# EAGLE design board (EAGLE 9.3.0)

## Sheet 1 of 2
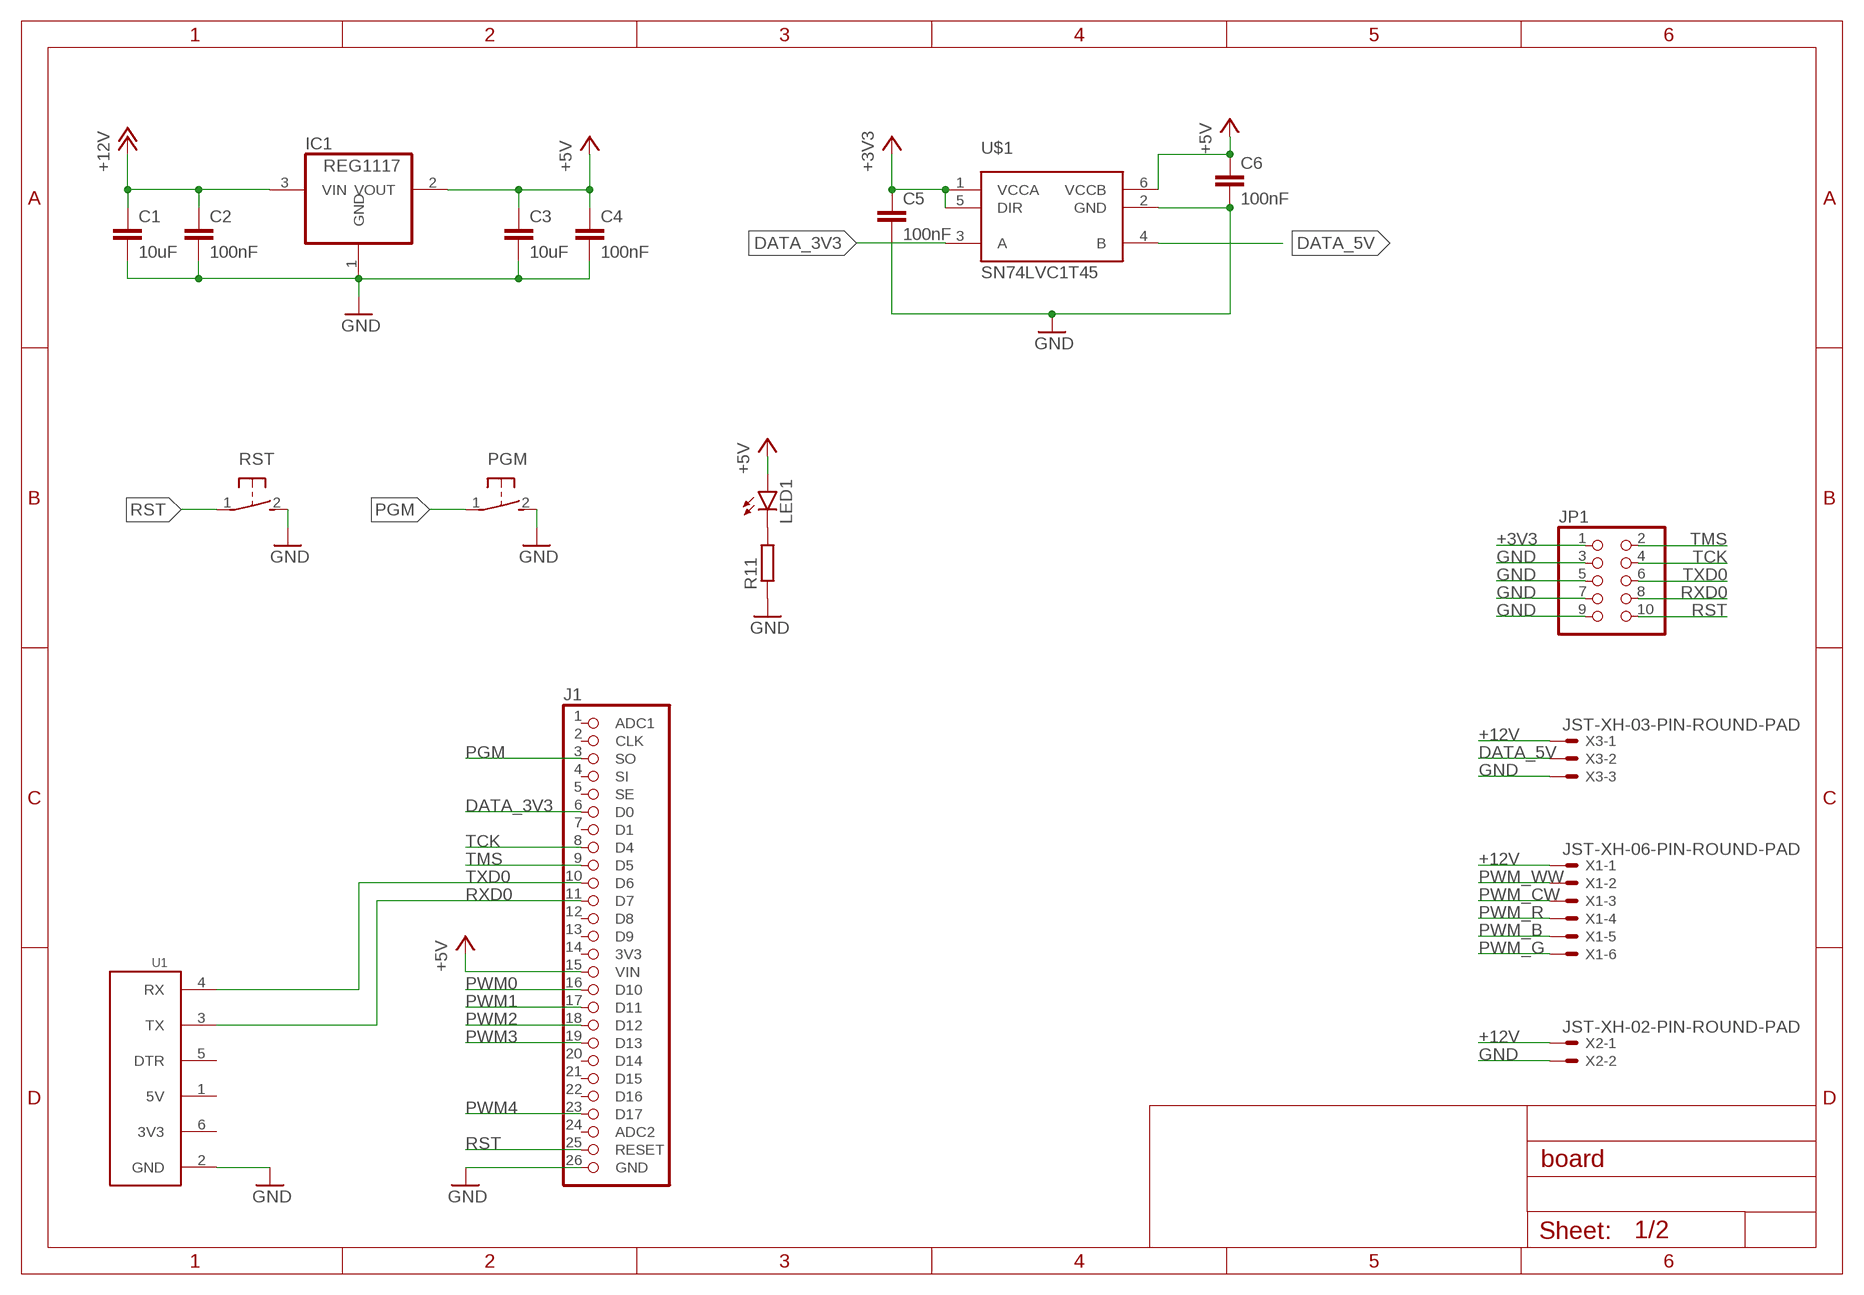
[diagram p0: schematic, sheet 1]

### Parts
C1  10uF  C-EUC0603  [C0603]
C2  100nF  C-EUC0603  [C0603]
C3  10uF  C-EUC0603  [C0603]
C4  100nF  C-EUC0603  [C0603]
C5  100nF  C-EUC0603  [C0603]
C6  100nF  C-EUC0603  [C0603]
IC1  REG1117  [SOT223]
J1  E75-2G4M20S-SOCKET  [E75-2G4M20S-SOCKET]
JP1  PINHD-2X5  [2X05]
LED1  LEDCHIP-LED0603  [CHIP-LED0603]
PGM  BUTTON3X4  [BUTTON3X4]
R11  R-EU_R0603  [R0603]
RST  BUTTON3X4  [BUTTON3X4]
U1  CP2102-BOARD  [CP2102-BOARD]
U$1  SN74LVC1T45  [SOT23-6]
X1  JST-XH-06-PIN-ROUND-PAD  [JST-XH-06-PACKAGE-ROUND-PAD]
X2  JST-XH-02-PIN-ROUND-PAD  [JST-XH-02-PACKAGE-ROUND-PAD]
X3  JST-XH-03-PIN-ROUND-PAD  [JST-XH-03-PACKAGE-ROUND-PAD]

### Nets
+3V3: C5.1 JP1.1 U$1.1(VCCA) U$1.5(DIR)
+5V: C3.1 C4.1 C6.1 IC1.2(VOUT) J1.15(VIN) LED1.A U$1.6(VCCB)
+12V: C1.1 C2.1 IC1.3(VIN) X1.1 X2.1 X3.1
DATA_3V3: J1.6(D0) U$1.3(A)
DATA_5V: U$1.4(B) X3.2
GND: C1.2 C2.2 C3.2 C4.2 C5.2 C6.2 IC1.1(GND) J1.26(GND) JP1.3 JP1.5 JP1.7 JP1.9 PGM.2(S) R11.1 RST.2(S) U1.2(GND) U$1.2(GND) X2.2 X3.3 ; also sheet 2
N$8: LED1.C R11.2
PGM: J1.3(SO) PGM.1(P)
PWM0: J1.16(D10) ; also sheet 2
PWM1: J1.17(D11) ; also sheet 2
PWM2: J1.18(D12) ; also sheet 2
PWM3: J1.19(D13) ; also sheet 2
PWM4: J1.23(D17) ; also sheet 2
PWM_B: X1.5 ; also sheet 2
PWM_CW: X1.3 ; also sheet 2
PWM_G: X1.6 ; also sheet 2
PWM_R: X1.4 ; also sheet 2
PWM_WW: X1.2 ; also sheet 2
RST: J1.25(RESET) JP1.10 RST.1(P)
RXD0: J1.11(D7) JP1.8 U1.3(TX)
TCK: J1.8(D4) JP1.4
TMS: J1.9(D5) JP1.2
TXD0: J1.10(D6) JP1.6 U1.4(RX)
Unconnected: J1.1(ADC1) J1.2(CLK) J1.4(SI) J1.5(SE) J1.7(D1) J1.12(D8) J1.13(D9) J1.14(3V3) J1.20(D14) J1.21(D15) J1.22(D16) J1.24(ADC2) U1.1(5V) U1.5(DTR) U1.6(3V3)

## Sheet 2 of 2
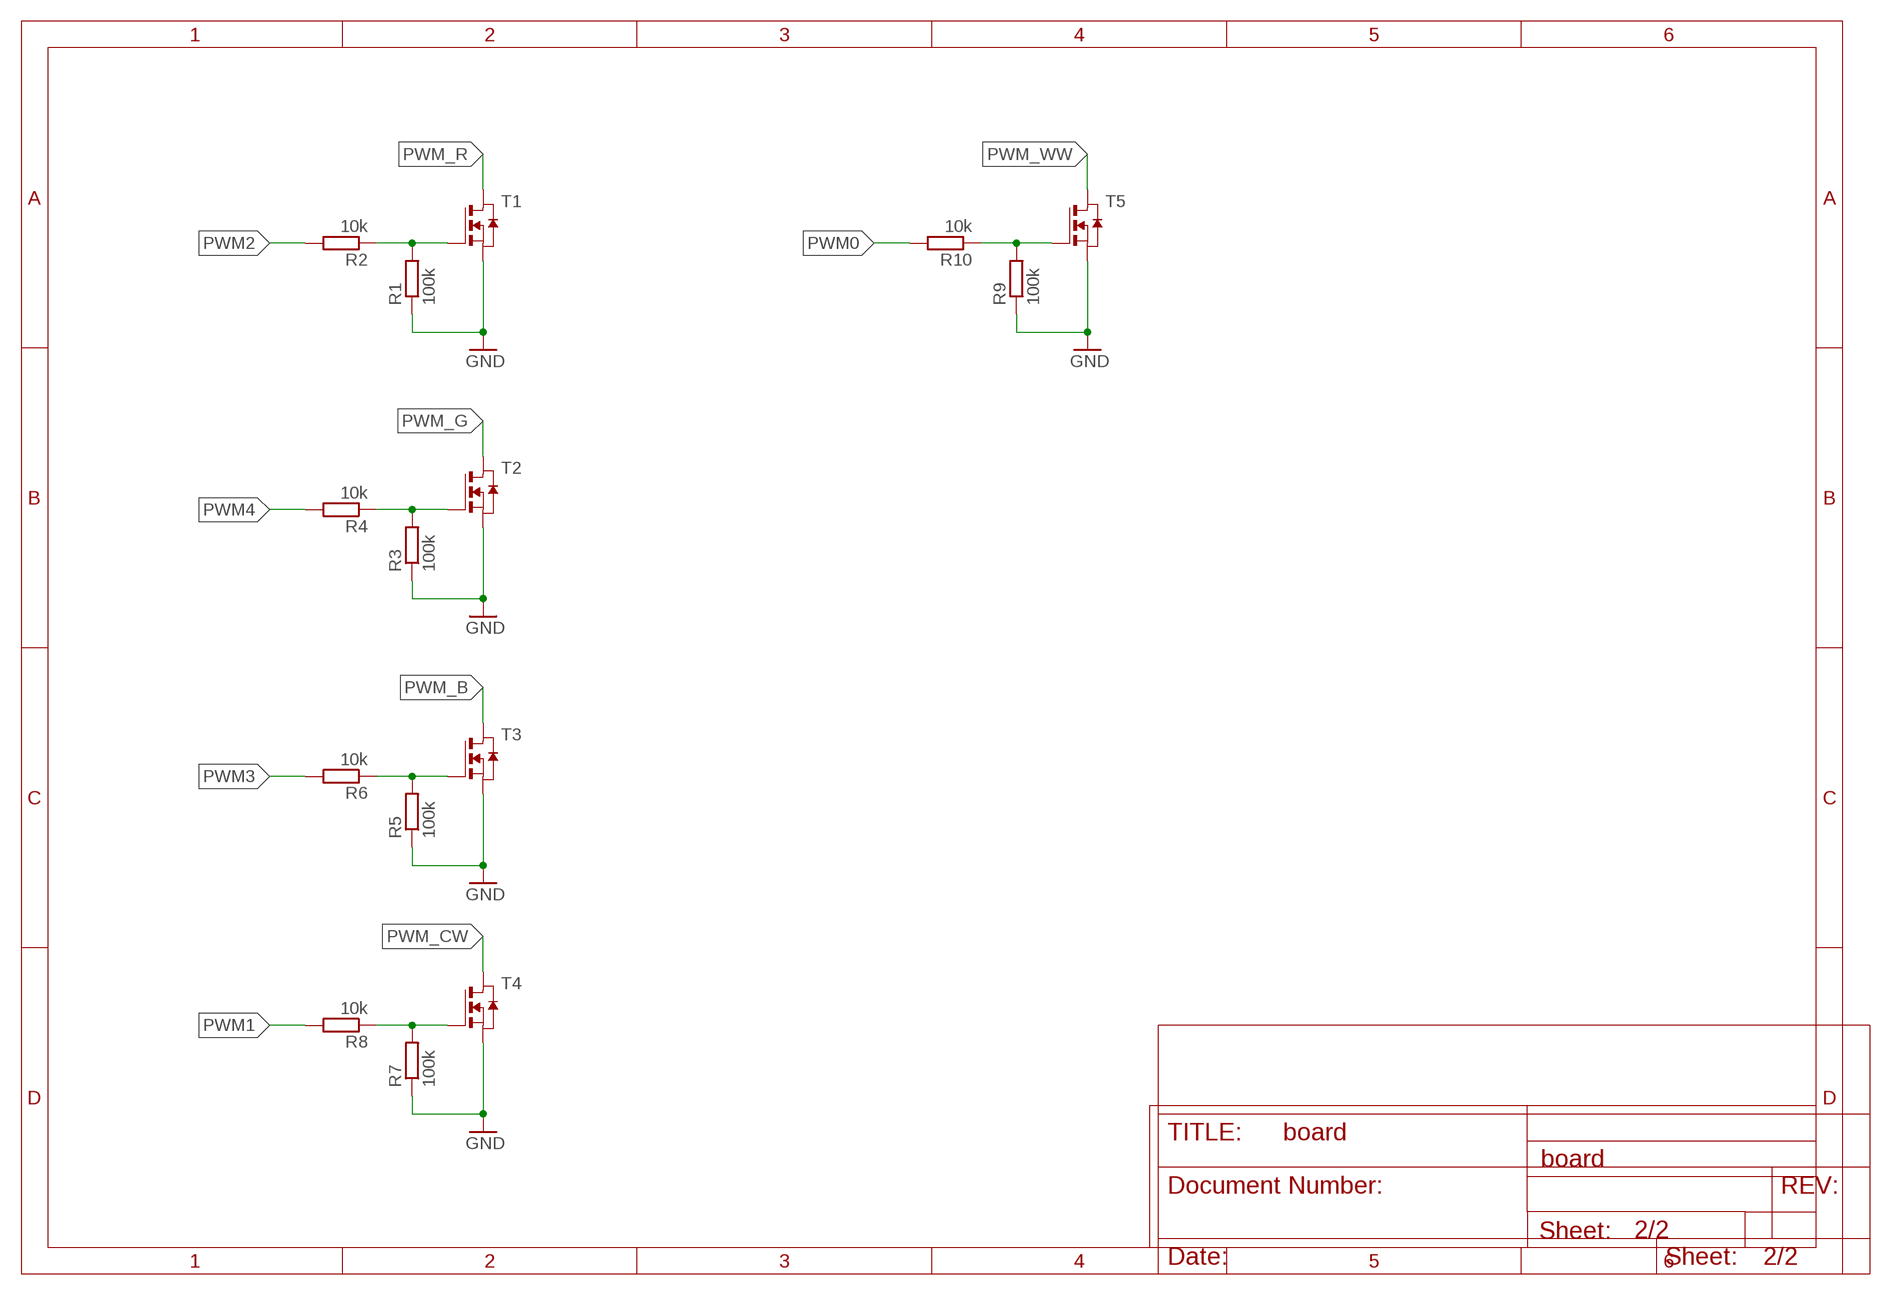
[diagram p1: schematic, sheet 2]

### Parts
R1  100k  R-EU_R0603  [R0603]
R2  10k  R-EU_R0603  [R0603]
R3  100k  R-EU_R0603  [R0603]
R4  10k  R-EU_R0603  [R0603]
R5  100k  R-EU_R0603  [R0603]
R6  10k  R-EU_R0603  [R0603]
R7  100k  R-EU_R0603  [R0603]
R8  10k  R-EU_R0603  [R0603]
R9  100k  R-EU_R0603  [R0603]
R10  10k  R-EU_R0603  [R0603]
T1  NMOSSOT23  [SOT-23]
T2  NMOSSOT23  [SOT-23]
T3  NMOSSOT23  [SOT-23]
T4  NMOSSOT23  [SOT-23]
T5  NMOSSOT23  [SOT-23]

### Nets
GND: R1.1 R3.1 R5.1 R7.1 R9.1 T1.2(S) T2.2(S) T3.2(S) T4.2(S) T5.2(S) ; also sheet 1
N$1: R1.2 R2.1 T1.3(G)
N$4: R3.2 R4.1 T2.3(G)
N$5: R5.2 R6.1 T3.3(G)
N$6: R7.2 R8.1 T4.3(G)
N$7: R9.2 R10.1 T5.3(G)
PWM0: R10.2 ; also sheet 1
PWM1: R8.2 ; also sheet 1
PWM2: R2.2 ; also sheet 1
PWM3: R6.2 ; also sheet 1
PWM4: R4.2 ; also sheet 1
PWM_B: T3.1(D) ; also sheet 1
PWM_CW: T4.1(D) ; also sheet 1
PWM_G: T2.1(D) ; also sheet 1
PWM_R: T1.1(D) ; also sheet 1
PWM_WW: T5.1(D) ; also sheet 1

## Library data of the parts
C1-C6 = rcl:C-EU: CAPACITOR, European symbol; SPICEPREFIX: C
IC1 = burr-brown:REG1117: 800mA and 1A Low Dropout (LDO) Positive Regulator 1.8V, 2.5V, 2.85V, 3.3V, 5V, and Adj; MPN: REG1117; OC_FARNELL: 1097566; OC_NEWARK: 14P6981
J1 = E75-2G4M20S:E75-2G4M20S-SOCKET
JP1 = pinhead:PINHD-2X5: PIN HEADER
LED1 = led:LED: LED OSRAM: - CHIPLED LG R971, LG N971, LY N971, LG Q971, LY Q971, LO R971, LY R971 LH N974, LH R974 LS Q976, LO Q976, LY Q976 LO Q996 - Hyper CHIPLED LW Q18S LB Q993, LB Q99A, LB R99A - SideLED LS A670, LO A670, LY A670, LG A670, LP A670 LB A673, LV A673, LT A673, LW A673 LH A674 LY A675 LS A676, LA A676, LO A676, LY A676, LW A676 LS A679, LY A679, LG A679 - Hyper Micro SIDELED® LS Y876, LA Y876, LO Y876, LY Y876 LT Y87S - SmartLED LW L88C, LW L88S LB L89C, LB L89S, LG L890 LS L89K, LO L89K, LY L89K LS L896, LA L896, LO L896, LY L896 - TOPLED LS T670, LO T670, LY T670, LG T670, LP T670 LSG T670, LSP T670, LSY T670, LOP T670, LYG T670 LG T671, LOG T671, LSG T671 LB T673, LV T673, LT T673, LW T673 LH T674 LS T676, LA T676, LO T676, LY T676, LB T676, LH T676, LSB T676, LW T676 LB T67C, LV T67C, LT T67C, LS T67K, LO T67K, LY T67K, LW E67C LS E67B, LA E67B, LO E67B, LY E67B, LB E67C, LV E67C, LT E67C LW T67C LS T679, LY T679, LG T679 LS T770, LO T770, LY T770, LG T770, LP T770 LB T773, LV T773, LT T773, LW T773 LH T774 LS E675, LA E675, LY E675, LS T675 LS T776, LA T776, LO T776, LY T776, LB T776 LHGB T686 LT T68C, LB T68C - Hyper Mini TOPLED® LB M676 - Mini TOPLED Santana® LG M470 LS M47K, LO M47K, LY M47K Source: http://www.osram.convergy.de LUXEON: - LUMILED® LXK2-PW12-R00, LXK2-PW12-S00, LXK2-PW14-U00, LXK2-PW14-V00 LXK2-PM12-R00, LXK2-PM12-S00, LXK2-PM14-U00 LXK2-PE12-Q00, LXK2-PE12-R00, LXK2-PE12-S00, LXK2-PE14-T00, LXK2-PE14-U00 LXK2-PB12-K00, LXK2-PB12-L00, LXK2-PB12-M00, LXK2-PB14-N00, LXK2-PB14-P00, LXK2-PB14-Q00 LXK2-PR12-L00, LXK2-PR12-M00, LXK2-PR14-Q00, LXK2-PR14-R00 LXK2-PD12-Q00, LXK2-PD12-R00, LXK2-PD12-S00 LXK2-PH12-R00, LXK2-PH12-S00 LXK2-PL12-P00, LXK2-PL12-Q00, LXK2-PL12-R00 Source: www.luxeon.com KINGBRIGHT: KA-3528ASYC Source: www.kingbright.com
PGM RST = E75-2G4M20S:BUTTON3X4
R1-R11 = rcl:R-EU_: RESISTOR, European symbol; SPICEPREFIX: R
T1-T5 = zetex:NMOSSOT23: MOS FET; OC_FARNELL: unknown; OC_NEWARK: unknown
U1 = E75-2G4M20S:CP2102-BOARD
U$1 = SN74LVC1T45:SN74LVC1T45; AVAILABILITY: Unavailable; DESCRIPTION: Single-Bit Dual-Supply Bus Transceiver with Configurable Voltage Translation and 3-State Outputs; MF: Texas Instruments; MP: SN74LVC1T45; PACKAGE: None; PRICE: None
X1 = Rembrandt Electronics - JST XH Connectors v1-0:JST-XH-06-PIN: JST XH Connector 2 Pin Wire to board connector. Pitch: 2,54 mm, (0.100") Number of pins: 6 Created by Rembrandt Electronics www.rembrandtelectronics.com
X2 = Rembrandt Electronics - JST XH Connectors v1-0:JST-XH-02-PIN: JST XH Connector 2 Pin Wire to board connector. Pitch: 2,54 mm, (0.100") Number of pins: 2 Created by Rembrandt Electronics www.rembrandtelectronics.com
X3 = Rembrandt Electronics - JST XH Connectors v1-0:JST-XH-03-PIN: JST XH Connector 2 Pin Wire to board connector. Pitch: 2,54 mm, (0.100") Number of pins: 3 Created by Rembrandt Electronics www.rembrandtelectronics.com

## Board
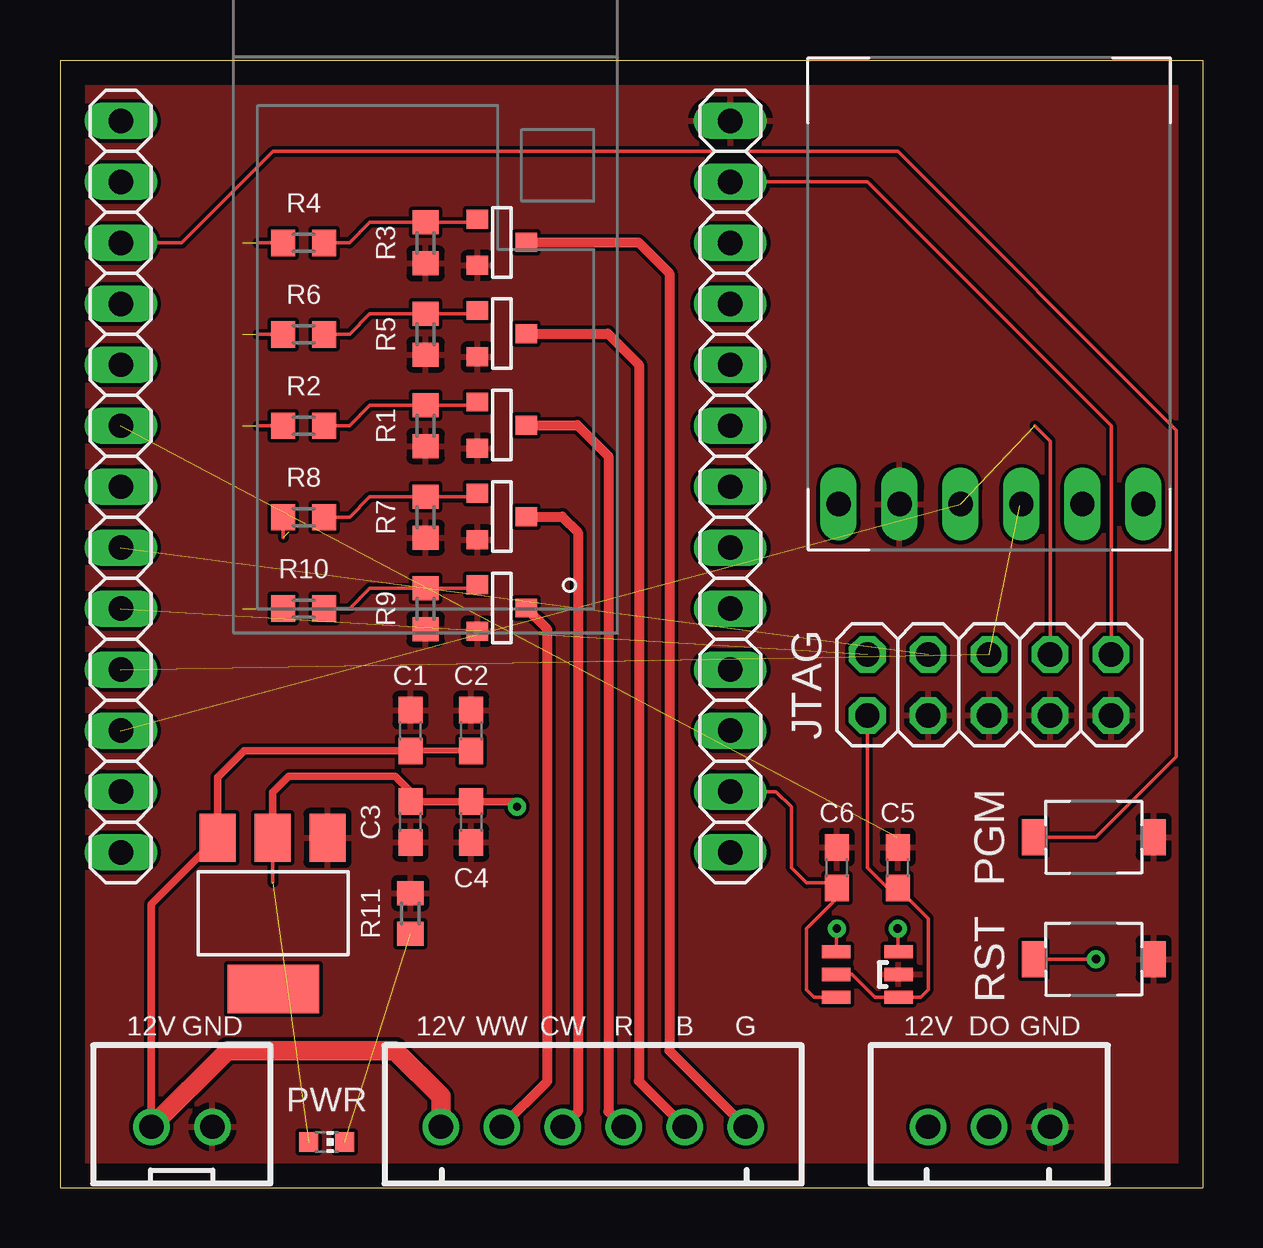
[diagram p2: board, top side]
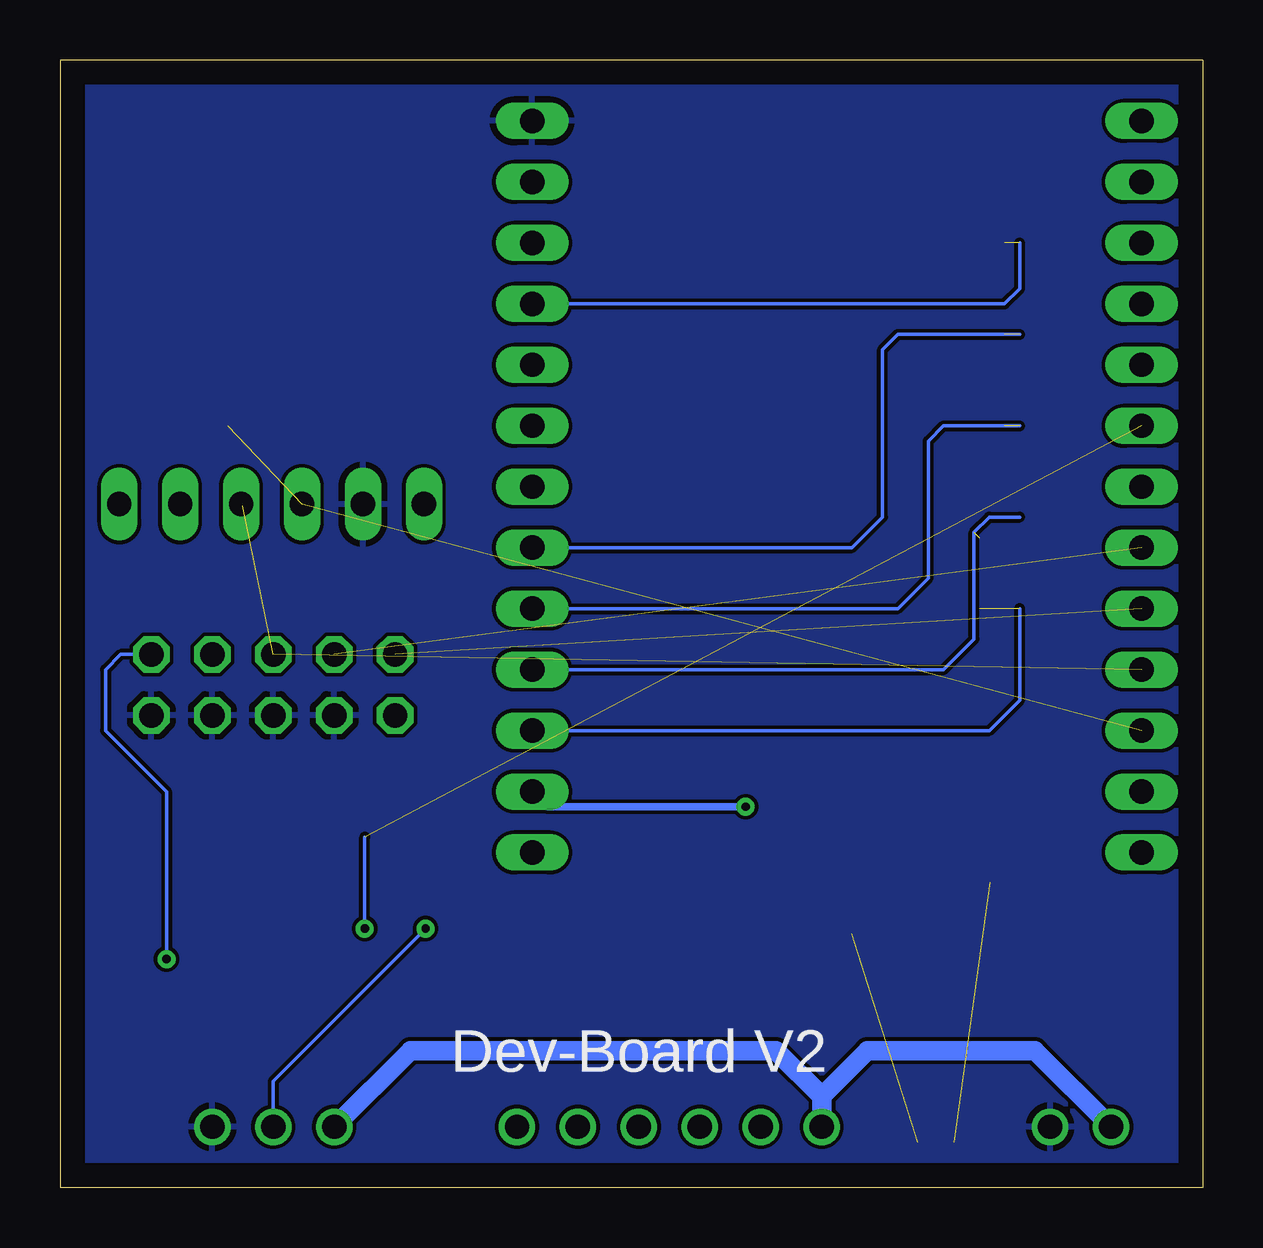
[diagram p3: board, bottom side, seen from below]

Size 47.62 x 46.99 mm. Coordinates in mm from the lower left corner, seen from the top.
Outline: 0,0 47.62,0 47.62,46.99 0,46.99 0,0
Copper layers (1*16): Top 0.035mm / dielectric 1.5mm / Bottom 0.035mm
Design rules "default": minimum track width 6mil, minimum drill 0.35mm, track to track 6mil, track to pad 6mil, pad to pad 6mil, via to via 6mil, smd to smd 6mil, copper to edge 40mil, drill to drill 6mil, minimum pad ring 10mil, minimum via ring 8mil, stop-mask expansion 4mil, vias tented up to drill 0mil, thermal gap 10mil

### Footprints (pad centres in the part's own frame; a part is rotated, then mirrored left to right if it is on the bottom)
C0603 = smd 1.1 x 1: 1 -0.85,0; 2 0.85,0
SOT223 = smd 1.499 x 2.007: 1 -2.261,-3.15; 2 0.025,-3.15; 3 2.311,-3.15 | smd 3.81 x 2.007: 4 0,3.15
E75-2G4M20S-SOCKET = drill 1.016 long: 1 -15.24,-12.7; 2 -12.7,-12.7; 3 -10.16,-12.7; 4 -7.62,-12.7; 5 -5.08,-12.7; 6 -2.54,-12.7; 7 0,-12.7; 8 2.54,-12.7; 9 5.08,-12.7; 10 7.62,-12.7; 11 10.16,-12.7; 12 12.7,-12.7; 13 15.24,-12.7; 14 15.24,12.7; 15 12.7,12.7; 16 10.16,12.7; 17 7.62,12.7; 18 5.08,12.7; 19 2.54,12.7; 20 0,12.7; 21 -2.54,12.7; 22 -5.08,12.7; 23 -7.62,12.7; 24 -10.16,12.7; 25 -12.7,12.7; 26 -15.24,12.7
2X05 = drill 1.016 octagon: 1 -5.08,-1.27; 2 -5.08,1.27; 3 -2.54,-1.27; 4 -2.54,1.27; 5 0,-1.27; 6 0,1.27; 7 2.54,-1.27; 8 2.54,1.27; 9 5.08,-1.27; 10 5.08,1.27
CHIP-LED0603 = smd 0.8 x 0.8: A 0,-0.75; C 0,0.75
BUTTON3X4 = smd 1 x 1.5: 1 -2.5,0; 2 2.5,0
R0603 = smd 1 x 1.1: 1 -0.85,0; 2 0.85,0
SOT-23 = smd 0.787 x 0.889: 1 0.025,-1.016; 2 -0.94,1.016; 3 0.991,1.016
CP2102-BOARD = drill 1.016 long: 1 -6.28,-8.345; 2 -3.74,-8.345; 3 -1.2,-8.345; 4 1.34,-8.345; 5 3.88,-8.345; 6 6.42,-8.345
SOT23-6 = smd 0.55 x 1.2: 1 -0.95,-1.3; 2 0,-1.3; 3 0.95,-1.3; 4 0.95,1.3; 5 0,1.3; 6 -0.95,1.3
JST-XH-06-PACKAGE-ROUND-PAD = drill 1.016: 1 -6.35,0; 2 -3.81,0; 3 -1.27,0; 4 1.27,0; 5 3.81,0; 6 6.35,0
JST-XH-02-PACKAGE-ROUND-PAD = drill 1.016: 1 -1.27,0; 2 1.27,0
JST-XH-03-PACKAGE-ROUND-PAD = drill 1.016: 1 -2.54,0; 2 0,0; 3 2.54,0

### Placement (x,y rotation side)
C1  14.61,19.05 90 top
C2  17.14,19.05 90 top
C3  14.61,15.24 270 top
C4  17.14,15.24 270 top
C5  34.92,13.34 90 top
C6  32.38,13.34 90 top
IC1  8.89,11.43 180 top
J1  15.24,29.21 270 top
JP1  38.73,20.95 0 top
LED1  11.11,1.91 270 top
PGM  43.09,14.61 0 top
R1  15.24,31.75 90 top
R2  10.16,31.75 180 top
R3  15.24,39.37 90 top
R4  10.16,39.37 180 top
R5  15.24,35.56 90 top
R6  10.16,35.56 180 top
R7  15.24,27.94 90 top
R8  10.16,27.94 180 top
R9  15.24,24.13 90 top
R10  10.16,24.13 180 top
R11  14.61,11.43 270 top
RST  43.09,9.53 0 top
T1  18.41,31.75 90 top
T2  18.41,39.37 90 top
T3  18.41,35.56 90 top
T4  18.41,27.94 90 top
T5  18.41,24.13 90 top
U1  38.73,36.83 0 top
U$1  33.66,8.89 90 top
X1  22.23,2.54 0 top
X2  5.08,2.54 0 top
X3  38.73,2.54 0 top

### Tracks (layer width: path | path; a pad name or v marks a point on that pad's centre or on a via)
+3V3
  Top 0.152: JP1.1 33.66,13.34 34.51,12.48 C5.1 36.2,11.21 36.2,8.26 35.88,7.94 U$1.1 33.97,7.94 33.02,8.89 U$1.5
+5V  (via drill 0.35)  (1 unrouted)
  Top 0.152: J1.15 29.84,16.51 30.48,15.88 30.48,13.34 31.11,12.7 32.17,12.7 C6.1 32.38,12.06 31.11,10.79 31.11,8.26 31.43,7.94 U$1.6 | IC1.2 8.87,12.72
  Top 0.305: IC1.2 8.87,16.48 9.53,17.14 13.97,17.14 14.61,16.51 C3.1 C4.1 18.84,16.09 v19.05,15.88
  Bottom 0.305: v19.05,15.88 27.3,15.88 J1.15
+12V
  Top 0.254: C2.1 C1.1
  Top 0.305: C1.1 7.68,18.2 6.58,17.09 IC1.3 3.81,11.81 X2.1
  Top 0.813: X2.1 6.99,5.71 13.97,5.71 15.88,3.81 X1.1
  Bottom 0.813: X3.1 33.02,5.71 17.78,5.71 15.88,3.81 | X2.1 6.99,5.71 13.97,5.71 15.88,3.81 | 15.88,3.81 X1.1
DATA_3V3  (via drill 0.35)  (1 unrouted)
  Top 0.152: 34.92,9.87 v34.92,10.79
  Top 0.254: U$1.3 arc-90 34.92,9.87
  Bottom 0.152: v34.92,10.79 34.92,14.61
DATA_5V  (via drill 0.35)
  Top 0.152: U$1.4 32.35,10.77 v32.38,10.79
  Bottom 0.152: v32.38,10.79 38.73,4.45 X3.2
GND
  Top 0.406: 15.33,34.62 R5.1 | T2.2 17.31,38.52 | T1.2 17.31,30.9
  pour Top: 0,0 0,46.99 47.62,46.99 47.62,0
  pour Bottom: 0,0 0,46.99 47.62,46.99 47.62,0
N$1
  Top 0.152: R2.1 12.06,31.75 12.91,32.6 R1.2 17.26,32.6 T1.3 17.68,33.02
  Top 0.406: 15.38,32.74 R1.2
N$4
  Top 0.152: R4.1 12.06,39.37 12.91,40.22 R3.2 17.26,40.22 T2.3 17.68,40.64
  Top 0.406: 15.38,40.36 R3.2
N$5
  Top 0.152: R6.1 12.06,35.56 12.91,36.41 R5.2 17.26,36.41 T3.3 17.68,36.83
  Top 0.406: 15.38,36.55 R5.2
N$6
  Top 0.152: R8.1 12.06,27.94 12.91,28.79 R7.2 17.26,28.79 T4.3
N$7
  Top 0.152: R10.1 12.06,24.13 12.91,24.98 R9.2 17.26,24.98 T5.3
N$8  (1 unrouted)
PGM
  Top 0.152: J1.3 5.08,39.37 8.89,43.18 34.92,43.18 46.53,31.57 46.53,17.96 43.18,14.61 PGM.1
PWM0  (1 unrouted)
  Bottom 0.152: J1.16 8.89,19.05 7.62,20.32 7.62,24.13
PWM1  (1 unrouted)
  Top 0.152: R8.2 9.31,27.09
  Bottom 0.152: J1.17 10.79,21.59 9.53,22.86 9.53,27.3 8.89,27.94 7.62,27.94
PWM2  (1 unrouted)
  Top 0.152: 8.26,31.75 R2.2
  Bottom 0.152: J1.18 12.7,24.13 11.43,25.4 11.43,31.11 10.79,31.75 7.62,31.75
PWM3  (1 unrouted)
  Top 0.152: 8.26,35.56 R6.2
  Bottom 0.152: J1.19 14.61,26.67 13.34,27.94 13.34,34.92 12.7,35.56 7.62,35.56
PWM4  (1 unrouted)
  Top 0.152: 8.26,39.37 R4.2
  Bottom 0.152: J1.23 8.26,36.83 7.62,37.47 7.62,39.37
PWM_B
  Top 0.406: X1.5 24.13,4.45 24.13,34.29 22.84,35.59 T3.1
PWM_CW
  Top 0.406: X1.3 21.59,3.17 21.59,27.3 20.93,27.96 T4.1
PWM_G
  Top 0.406: X1.6 25.4,5.71 25.4,38.1 24.11,39.4 T2.1
PWM_R
  Top 0.406: X1.4 22.86,3.17 22.86,30.48 21.57,31.77 T1.1
PWM_WW
  Top 0.406: X1.2 20.32,4.45 20.32,23.27 T5.1
RST  (via drill 0.35)
  Top 0.152: J1.25 33.66,41.91 43.81,31.75 JP1.10 | RST.1 v43.18,9.53
  Bottom 0.152: JP1.10 45.09,22.23 45.72,21.59 45.72,19.05 43.18,16.51 v43.18,9.53
RXD0  (2 unrouted)
  Top 0.152: JP1.8 41.27,31.11 40.64,31.75
TCK  (1 unrouted)
TMS  (1 unrouted)
TXD0  (2 unrouted)
  Bottom 0.152: U1.4 40.01,28.41

### Text on the board
tPlace: JTAG | 12V | GND | 12V | WW | CW | R | B | G | 12V | DO | GND | PWR
bPlace: Dev-Board V2